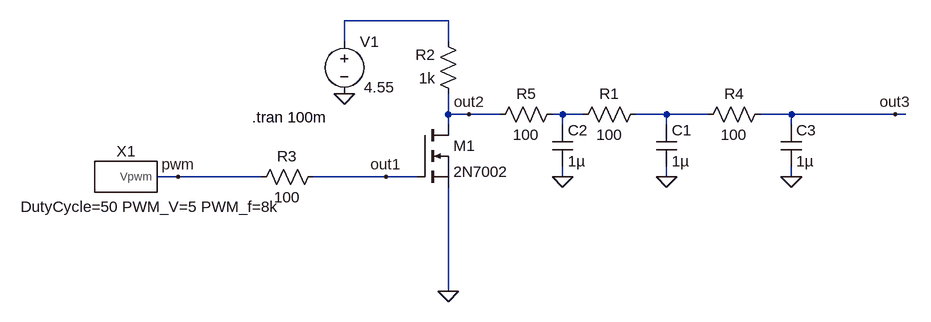
[diagram p0: schematic pwm.asc]
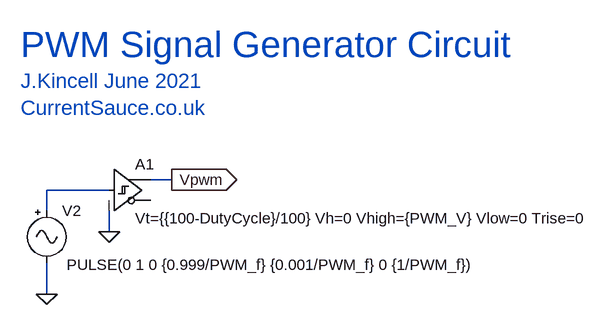
[diagram p1: sub-circuit pwm_gen.asc]
pwm.asc, the LTspice schematic file:
Version 4
SHEET 1 1368 680
WIRE 432 -144 272 -144
WIRE 272 -112 272 -144
WIRE 432 -112 432 -144
WIRE 432 0 432 -32
WIRE 464 0 432 0
WIRE 512 0 464 0
WIRE 608 0 592 0
WIRE 640 0 608 0
WIRE 768 0 720 0
WIRE 832 0 768 0
WIRE 960 0 912 0
WIRE 1120 0 960 0
WIRE 1136 0 1120 0
WIRE 432 16 432 0
WIRE 608 16 608 0
WIRE 768 16 768 0
WIRE 960 16 960 0
WIRE 16 96 -16 96
WIRE 144 96 16 96
WIRE 336 96 224 96
WIRE 384 96 336 96
WIRE 608 96 608 80
WIRE 768 96 768 80
WIRE 960 96 960 80
WIRE 432 272 432 112
FLAG 16 96 pwm
FLAG 768 96 0
FLAG 432 272 0
FLAG 608 96 0
FLAG 960 96 0
FLAG 272 -32 0
FLAG 336 96 out1
FLAG 464 0 out2
FLAG 1120 0 out3
SYMBOL PWM_Gen -64 96 R0
WINDOW 39 37 62 Bottom 2
SYMATTR SpiceLine DutyCycle=50 PWM_V=5 PWM_f=8k
SYMATTR InstName X1
SYMBOL cap 752 16 R0
SYMATTR InstName C1
SYMATTR Value 1µ
SYMBOL res 736 -16 R90
WINDOW 0 0 56 VBottom 2
WINDOW 3 32 56 VTop 2
SYMATTR InstName R1
SYMATTR Value 100
SYMBOL res 448 -16 R180
WINDOW 0 36 76 Left 2
WINDOW 3 36 40 Left 2
SYMATTR InstName R2
SYMATTR Value 1k
SYMBOL cap 592 16 R0
SYMATTR InstName C2
SYMATTR Value 1µ
SYMBOL res 240 80 R90
WINDOW 0 0 56 VBottom 2
WINDOW 3 32 56 VTop 2
SYMATTR InstName R3
SYMATTR Value 100
SYMBOL cap 944 16 R0
SYMATTR InstName C3
SYMATTR Value 1µ
SYMBOL res 928 -16 R90
WINDOW 0 0 56 VBottom 2
WINDOW 3 32 56 VTop 2
SYMATTR InstName R4
SYMATTR Value 100
SYMBOL nmos 384 16 R0
SYMATTR InstName M1
SYMATTR Value 2N7002
SYMBOL voltage 272 -128 R0
WINDOW 123 24 44 Left 2
WINDOW 39 0 0 Left 0
WINDOW 3 30 86 Left 2
SYMATTR Value 4.55
SYMATTR InstName V1
SYMBOL res 608 -16 R90
WINDOW 0 0 56 VBottom 2
WINDOW 3 32 56 VTop 2
SYMATTR InstName R5
SYMATTR Value 100
TEXT 130 4 Left 2 !.tran 100m

pwm_gen.asc, the sub-circuit schematic file:
Version 4
SHEET 1 880 680
WIRE -1296 64 -1328 64
WIRE -1392 80 -1488 80
WIRE -1488 112 -1488 80
WIRE -1392 144 -1392 112
WIRE -1488 240 -1488 192
FLAG -1488 240 0
FLAG -1296 64 Vpwm
IOPIN -1296 64 Out
FLAG -1392 144 0
SYMBOL Misc\\signal -1488 96 R0
WINDOW 123 0 0 Left 0
WINDOW 39 0 0 Left 0
WINDOW 3 31 99 Left 2
SYMATTR Value PULSE(0 1 0 {0.999/PWM_f} {0.001/PWM_f} 0 {1/PWM_f})
SYMATTR InstName V2
SYMBOL Digital\\schmitt -1392 16 R0
WINDOW 3 40 107 Left 2
SYMATTR Value Vt={{100-DutyCycle}/100} Vh=0 Vhigh={PWM_V} Vlow=0 Trise=0
SYMATTR InstName A1
TEXT -1528 -144 Left 5 ;PWM Signal Generator Circuit
TEXT -1528 -88 Left 3 ;J.Kincell June 2021\nCurrentSauce.co.uk

The netlist it stands for:
* pwm.asc
XX1 pwm pwm_gen params: DutyCycle=50 PWM_V=5 PWM_f=8k
C1 N003 0 1µ
R1 N003 N002 100
R2 out2 N001 1k
C2 N002 0 1µ
R3 out1 pwm 100
C3 out3 0 1µ
R4 out3 N003 100
M1 out2 out1 0 0 2N7002
V1 N001 0 4.55
R5 N002 out2 100

* block symbol definitions
.subckt pwm_gen Vpwm
V2 N001 0 PULSE(0 1 0 {0.999/PWM_f} {0.001/PWM_f} 0 {1/PWM_f})
A1 N001 0 0 0 0 0 Vpwm 0 SCHMITT Vt={{100-DutyCycle}/100} Vh=0 Vhigh={PWM_V} Vlow=0 Trise=0
* PWM Signal Generator Circuit
* J.Kincell June 2021
* CurrentSauce.co.uk
.ends pwm_gen

.model NMOS NMOS
.model PMOS PMOS
.lib standard.mos
.tran 100m
.backanno
.end